# Altium schematic sheet TLD.SchDoc
size A; SheetNumber: 1; SheetTotal: 6
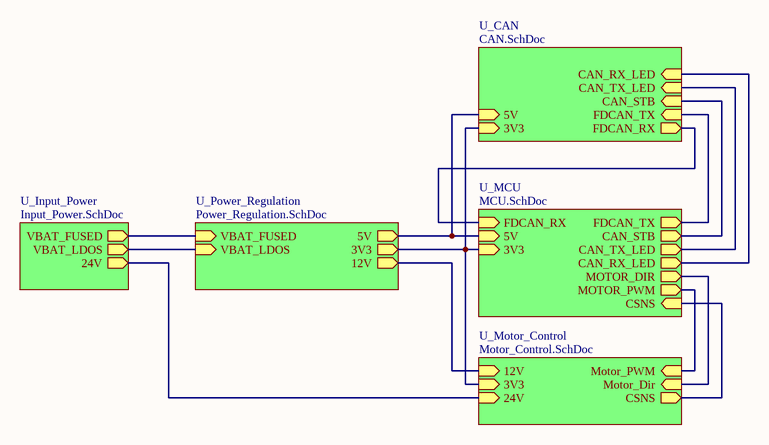
[diagram p0: TLD.SchDoc]

## Sub-sheets
U_CAN = CAN.SchDoc: FDCAN_RX (out), FDCAN_TX (in), CAN_TX_LED (in), CAN_RX_LED (in), CAN_STB (in), 5V (in), 3V3 (in)
U_Input_Power = Input_Power.SchDoc: VBAT_FUSED (out), VBAT_LDOS (out), 24V (out)
U_MCU = MCU.SchDoc: MOTOR_PWM (out), MOTOR_DIR (out), CAN_TX_LED (out), CAN_RX_LED (out), FDCAN_TX (out), FDCAN_RX (in), 5V (in), 3V3 (in), CAN_STB (out), CSNS (in)
U_Motor_Control = Motor_Control.SchDoc: Motor_PWM (in), Motor_Dir (in), 12V (in), 3V3 (in), CSNS (out), 24V (in)
U_Power_Regulation = Power_Regulation.SchDoc: 5V (out), 3V3 (out), 12V (out), VBAT_FUSED (in), VBAT_LDOS (in)

## Nets
(unnamed): sheet U_CAN/FDCAN_RX, sheet U_MCU/FDCAN_RX
(unnamed): sheet U_CAN/FDCAN_TX, sheet U_MCU/FDCAN_TX
(unnamed): sheet U_CAN/CAN_TX_LED, sheet U_MCU/CAN_TX_LED
(unnamed): sheet U_CAN/CAN_RX_LED, sheet U_MCU/CAN_RX_LED
(unnamed): sheet U_CAN/CAN_STB, sheet U_MCU/CAN_STB
(unnamed): sheet U_CAN/5V, sheet U_MCU/5V, sheet U_Power_Regulation/5V
(unnamed): sheet U_CAN/3V3, sheet U_MCU/3V3, sheet U_Motor_Control/3V3, sheet U_Power_Regulation/3V3
(unnamed): sheet U_Input_Power/VBAT_FUSED, sheet U_Power_Regulation/VBAT_FUSED
(unnamed): sheet U_Input_Power/VBAT_LDOS, sheet U_Power_Regulation/VBAT_LDOS
(unnamed): sheet U_Input_Power/24V, sheet U_Motor_Control/24V
(unnamed): sheet U_MCU/MOTOR_PWM, sheet U_Motor_Control/Motor_PWM
(unnamed): sheet U_MCU/MOTOR_DIR, sheet U_Motor_Control/Motor_Dir
(unnamed): sheet U_MCU/CSNS, sheet U_Motor_Control/CSNS
(unnamed): sheet U_Motor_Control/12V, sheet U_Power_Regulation/12V